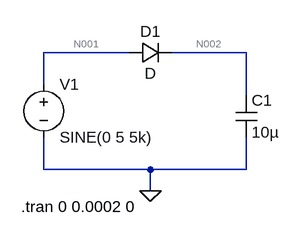
[diagram p0: schematic Draft1.asc]
Draft1.asc, the LTspice schematic file:
Version 4
SHEET 1 880 680
WIRE 208 96 80 96
WIRE 384 96 272 96
WIRE 80 144 80 96
WIRE 384 160 384 96
WIRE 80 272 80 224
WIRE 240 272 80 272
WIRE 384 272 384 224
WIRE 384 272 240 272
WIRE 240 304 240 272
FLAG 240 304 0
SYMBOL voltage 80 128 R0
WINDOW 123 0 0 Left 0
WINDOW 39 0 0 Left 0
SYMATTR InstName V1
SYMATTR Value SINE(0 5 5k)
SYMBOL diode 208 112 R270
WINDOW 0 32 32 VTop 2
WINDOW 3 0 32 VBottom 2
SYMATTR InstName D1
SYMBOL cap 368 160 R0
SYMATTR InstName C1
SYMATTR Value 10µ
TEXT 46 328 Left 2 !.tran 0 0.0002 0

The netlist it stands for:
* Draft1.asc
V1 N001 0 SINE(0 5 5k)
D1 N001 N002 D
C1 N002 0 10µ
.model D D
.lib standard.dio
.tran 0 0.0002 0
.backanno
.end

* Results of the author's LTspice run, read from the files saved beside the schematic
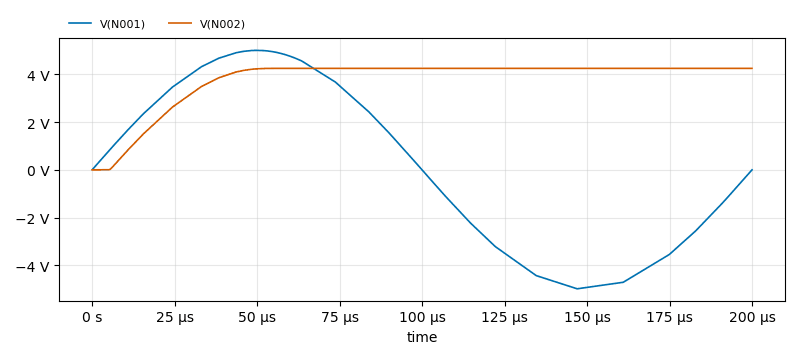
[diagram p1: Transient Analysis of Draft1.asc, plotted from the saved traces]
* Transient Analysis, 1 run:
*   V(N001): min -4.978 V, max 5 V, average 12.93 mV, rms 3.523 V, last 0 V
*   V(N002): min 0 V, max 4.246 V, average 3.782 V, rms 3.938 V, last 4.246 V